# EAGLE board EEZ PSU power board r5B8 (EAGLE 6.1), part 1 of 2
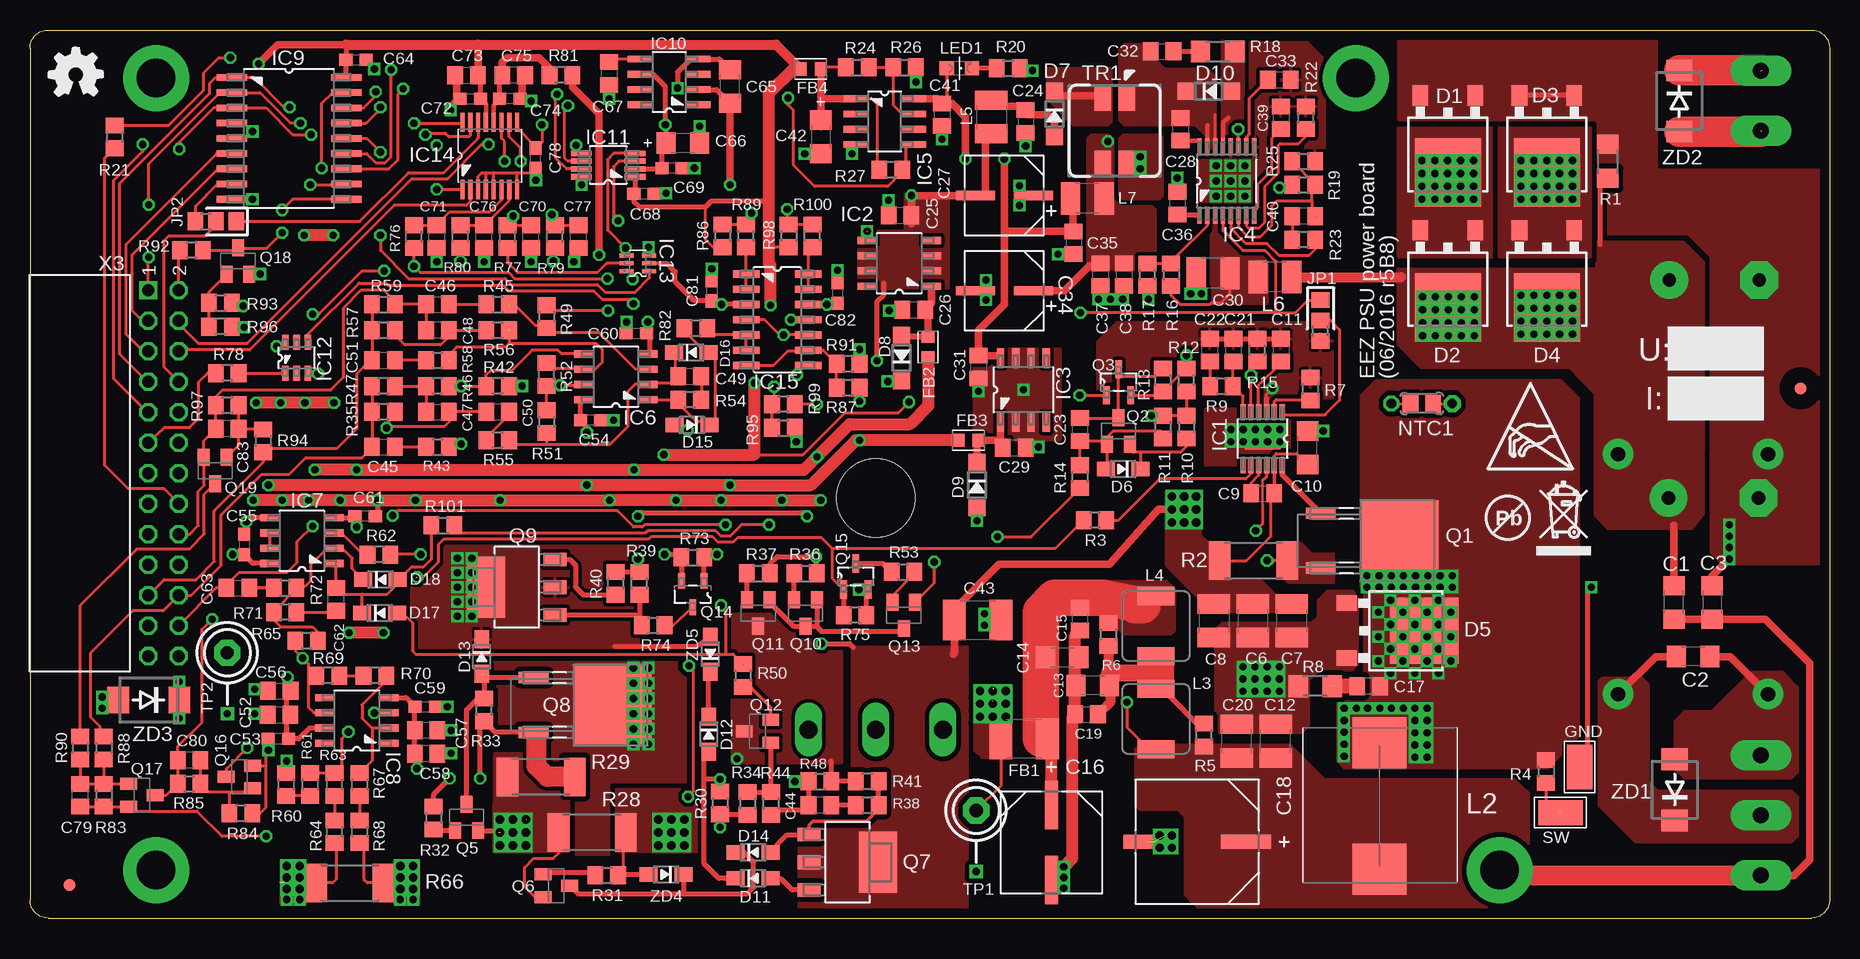
[diagram p5: board, top side]
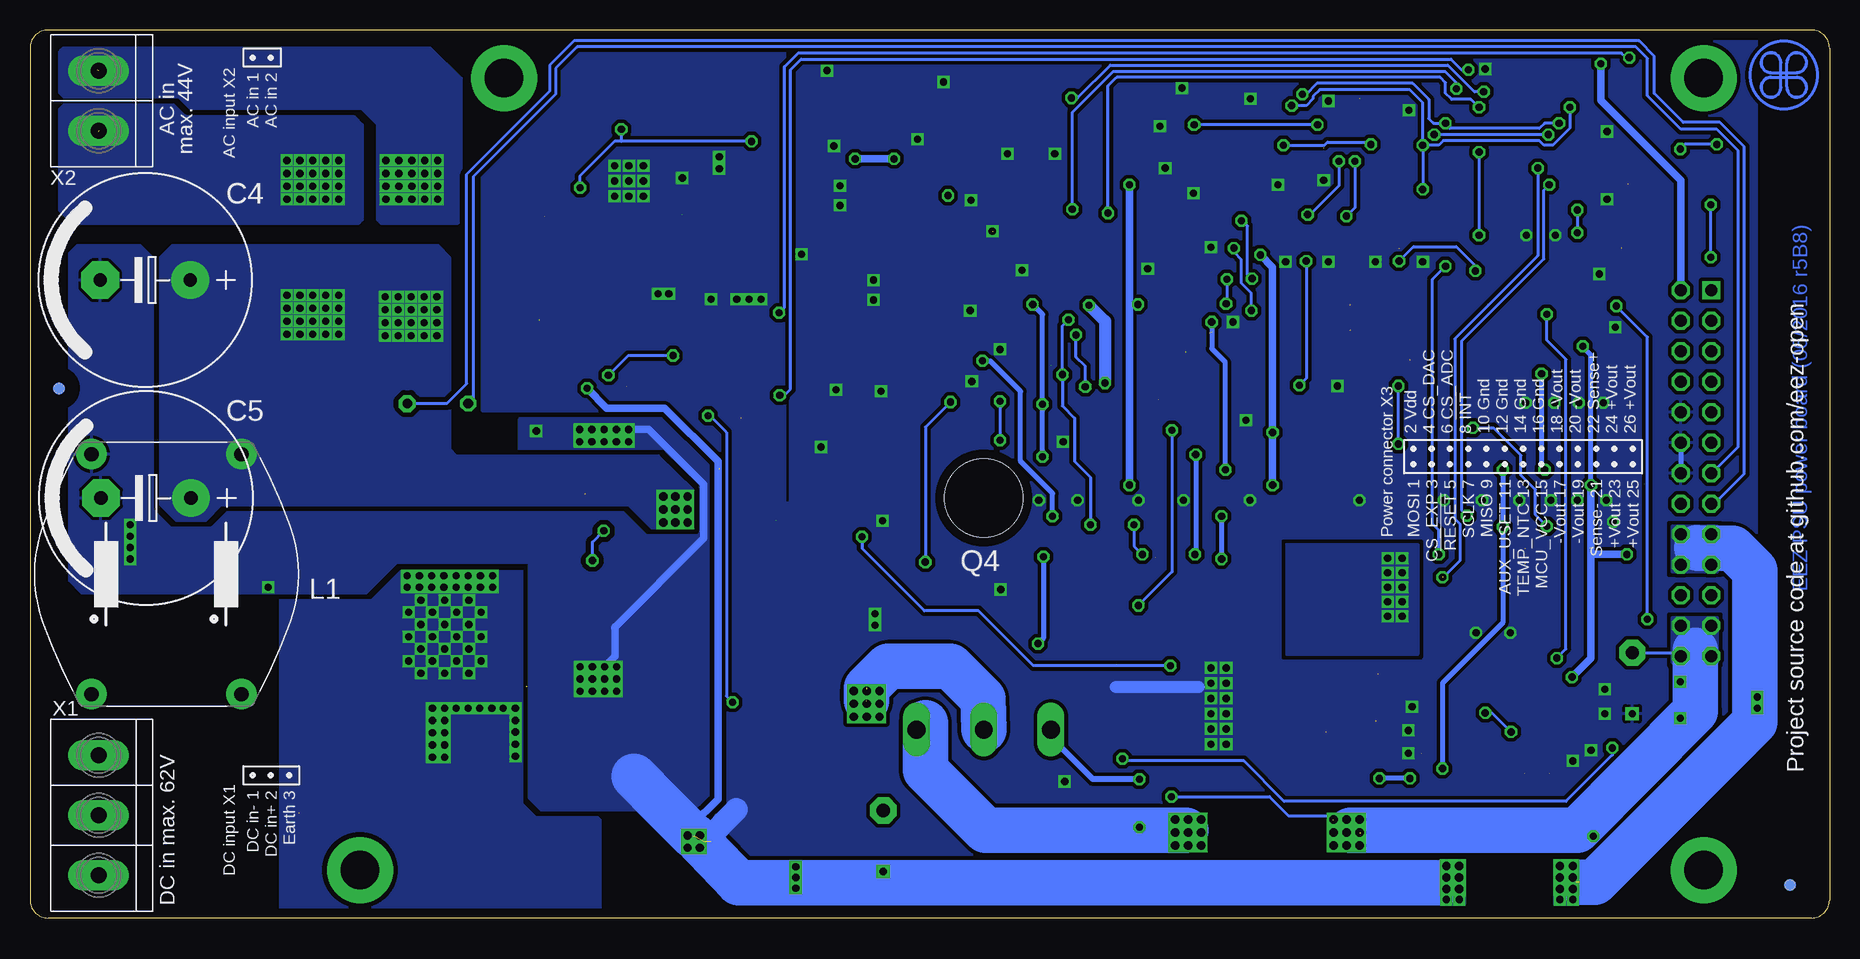
[diagram p6: board, bottom side, seen from below]

Size 150 x 74 mm. Coordinates in mm from the lower left corner, seen from the top.
Outline: 1.5,0 148.5,0 arc90 150,1.5 150,72.5 arc90 148.5,74 1.5,74 arc90 0,72.5 0,1.5 arc90 1.5,0
Copper layers (1+5*16): Top 0.035mm / dielectric 0.75mm / Route5 0.035mm / dielectric 0.75mm / Bottom 0.035mm
Design rules: minimum track width 10mil, minimum drill 0.5mm, track to track 8mil, track to pad 8mil, pad to pad 8mil, via to via 8mil, smd to smd 8mil, copper to edge 30mil, drill to drill 8mil, minimum pad ring 10mil, minimum via ring 8mil, stop-mask expansion 4mil, vias tented up to drill 25mil, thermal gap 10mil
Net classes: 0 default: width 0.254 mm, drill 0.584 mm, clearance 0.254 mm; 1 dgnd: width 0.254 mm, drill 0.584 mm, clearance 0.254 mm; 2 gnd: width 0.254 mm, drill 0.584 mm, clearance 0.254 mm

## Footprints (pad centres in the part's own frame; a part is rotated, then mirrored left to right if it is on the bottom)
C1206 = smd 1.6 x 1.8: 1 -1.4,0; 2 1.4,0
ECAP7.5/18 = drill 1.1 pad 3.14: + -3.75,0 | drill 1.1 pad 3.14 octagon: - 3.75,0
C1210 = smd 1.6 x 2.7: 1 -1.4,0; 2 1.4,0
C0805 = smd 1.3 x 1.5: 1 -0.95,0; 2 0.95,0
CAPAE830X1050N = smd 4.064 x 1.092: 1 -3.124,0; 2 3.124,0
PANASONIC_F = smd 4.166 x 1.194: 1 -4.064,0; 2 4.064,0
CAPAE660X610N = smd 3.251 x 0.762: 1 -2.413,0; 2 2.413,0
EC1206 = smd 1.6 x 1.8: + -1.4,0; - 1.4,0
C1812 = smd 1.9 x 3.4: 1 -1.95,0; 2 1.95,0
C0603 = smd 1.1 x 1: 1 -0.85,0; 2 0.85,0
TO252@1 = smd 1.3 x 1.7: 1 -2.285,-5.49; 2 2.285,-5.49 | smd 5.5 x 5.7: 3 0,0.95
TO252 = smd 1.3 x 1.7: 1 -2.285,-5.49; 2 2.285,-5.49 | smd 5.5 x 5.7: 3 0,0.95
SOD323-W = smd 1.5 x 1.2: A 1.45,0; C -1.45,0
SOD123 = smd 1.4 x 1.4: A 1.9,0; C -1.9,0
L1812 = smd 1.9 x 3.4: 1 -1.95,0; 2 1.95,0
BEAD0603 = smd 1 x 1.1: P$1 -0.85,0; P$2 0.85,0
S1751-46R = smd 3.7 x 2.1: P$1 0,0
LTC_05-08-1666 = smd 1.27 x 0.457: 1 -2.235,1.63; 2 -2.235,0.98; 3 -2.235,0.33; 4 -2.235,-0.33; 5 -2.235,-0.98; 6 -2.235,-1.63; 7 2.235,-1.63; 8 2.235,-0.98; 9 2.235,-0.33; 10 2.235,0.33; 11 2.235,0.98; 12 2.235,1.63 | smd 1.753 x 2.946: TP 0,0
SOIC127P600X173-8N = smd 1.55 x 0.6: 1 -2.7,1.9; 2 -2.7,0.63; 3 -2.7,-0.64; 4 -2.7,-1.91; 5 2.7,-1.91; 6 2.7,-0.64; 7 2.7,0.63; 8 2.7,1.9
SOP65P640X110-16N = smd 1.422 x 0.356: 1 -2.845,2.286; 2 -2.845,1.626; 3 -2.845,0.965; 4 -2.845,0.33; 5 -2.845,-0.33; 6 -2.845,-0.965; 7 -2.845,-1.626; 8 -2.845,-2.286; 9 2.845,-2.286; 10 2.845,-1.626; 11 2.845,-0.965; 12 2.845,-0.33; 13 2.845,0.33; 14 2.845,0.965; 15 2.845,1.626; 16 2.845,2.286
SOIC127P600X175-8N = smd 1.981 x 0.559: 1 -2.464,1.905; 2 -2.464,0.635; 3 -2.464,-0.635; 4 -2.464,-1.905; 5 2.464,-1.905; 6 2.464,-0.635; 7 2.464,0.635; 8 2.464,1.905
SOIC127P1030X265-18N = smd 2.54 x 0.559: 1 -4.775,5.08; 2 -4.775,3.81; 3 -4.775,2.54; 4 -4.775,1.27; 5 -4.775,0; 6 -4.775,-1.27; 7 -4.775,-2.54; 8 -4.775,-3.81; 9 -4.775,-5.08; 10 4.775,-5.08; 11 4.775,-3.81; 12 4.775,-2.54; 13 4.775,-1.27; 14 4.775,0; 15 4.775,1.27; 16 4.775,2.54; 17 4.775,3.81; 18 4.775,5.08
DGK8-M = smd 1.727 x 0.483: 1 -2.235,0.965; 2 -2.235,0.33; 3 -2.235,-0.33; 4 -2.235,-0.965; 5 2.235,-0.965; 6 2.235,-0.33; 7 2.235,0.33; 8 2.235,0.965
SOT95P280X145-6N = smd 1.27 x 0.559: 1 -1.295,0.94; 2 -1.295,0; 3 -1.295,-0.94; 4 1.295,-0.94; 5 1.295,0; 6 1.295,0.94
SOT65P210X110-6N = smd 1.168 x 0.356: 1 -0.94,0.66; 2 -0.94,0; 3 -0.94,-0.66; 4 0.94,-0.66; 5 0.94,0; 6 0.94,0.66
PW(R-PDSO-G16) = smd 1.6 x 0.35: 1 -2.8,2.3; 2 -2.8,1.65; 3 -2.8,1; 4 -2.8,0.35; 5 -2.8,-0.3; 6 -2.8,-0.95; 7 -2.8,-1.6; 8 -2.8,-2.25; 9 2.8,-2.25; 10 2.8,-1.6; 11 2.8,-0.95; 12 2.8,-0.3; 13 2.8,0.35; 14 2.8,1; 15 2.8,1.65; 16 2.8,2.3
SOIC127P600X175-14N = smd 2.2 x 0.6: 1 -2.591,3.81; 2 -2.591,2.54; 3 -2.591,1.27; 4 -2.591,0; 5 -2.591,-1.27; 6 -2.591,-2.54; 7 -2.591,-3.81; 8 2.591,-3.81; 9 2.591,-2.54; 10 2.591,-1.27; 11 2.591,0; 12 2.591,1.27; 13 2.591,2.54; 14 2.591,3.81
A0R-JMP = smd 1.5 x 1.3: 1 0,1.7; 2 0,0; 3 0,-1.7
RN114 = drill 1.2 pad 2.54: 1 -10,6.25; 2 -10,-6.25; 3 10,-6.25; 4 10,6.25
WE-HCI_1350/1365 = smd 4.25 x 4.5: 1 -5.25,0; 2 5.27,0
IHLP-2020BZ-11 = smd 3.048 x 1.524: 1 0,2.515; 2 0,-2.515
L1210 = smd 1.6 x 2.7: 1 -1.4,0; 2 1.4,0
LED_0805 = smd 1.2 x 1.2: A 0,-1.05; C 0,1.05
R_0204/5+0805 = smd 1.3 x 1.5: 1 -0.95,0; 2 0.95,0 | drill 0.813 octagon: 1.1 -2.54,0 | drill 0.8 pad 1.422 octagon: 2.1 2.54,0
TO229P990X239-3N = smd 0.94 x 2.489: 1 -2.286,-6.401; 3 2.286,-6.401 | smd 6.731 x 6.528: 2 0,0.152
SOT23-BEC = smd 1 x 1.4: B -0.95,-1.1; C 0,1.1; E 0.95,-1.1
SOT103P240X110-3N = smd 1.524 x 0.559: 1 -1.079,1.016; 2 -1.079,-1.016; 3 1.079,0
TO247BH-CLR = drill 1.499 long: D 0,-19.304; G -5.588,-19.304; S 5.588,-19.304 | hole 6.5: 0,0
SOT230P700X180-4N = smd 1.905 x 1.143: 1 -3.2,2.311; 2 -3.2,0; 3 -3.2,-2.311 | smd 3.175 x 5.08: 4 2.565,0
SOT95P237X112-3N = smd 1.321 x 0.559: 1 -1.092,0.94; 2 -1.092,-0.94; 3 1.092,0
R1206 = smd 1.6 x 1.803: 1 -1.422,0; 2 1.422,0
R2512 = smd 1.8 x 3.2: 1 -2.8,0; 2 2.8,0
R0805 = smd 1.3 x 1.5: 1 -0.95,0; 2 0.95,0
SHORT_NOHOLE = smd 0.5 x 0.25 bottom: P$1 0,0.117; P$2 0,-0.117
TP_1.1MM = drill 0.6 square: GND 5.08,0 | drill 1.1 pad 2.184 octagon: TIP 0,0
SRF0703 = smd 1.4 x 2.1: 1 1,2.7; 2 -1,2.7; 3 -1,-2.7; 4 1,-2.7
FIDUCIAL_DUAL = smd 1.016 x 1.016 bottom: B 0,0 | smd 1.016 x 1.016: T 0,0
TBLOCK5.0_3 = drill 1.35 pad 2.54 long: 1 0,0; 2 0,-5; 3 0,-10
TBLOCK5.0_2 = drill 1.35 pad 2.54 long: 1 0,0; 2 0,-5
SSW-113-02-T-D-RA = drill 1 pad 1.5 square: 1 30.48,2.54 | drill 1 pad 1.5 octagon: 2 30.48,0; 3 27.94,2.54; 4 27.94,0; 5 25.4,2.54; 6 25.4,0; 7 22.86,2.54; 8 22.86,0; 9 20.32,2.54; 10 20.32,0; 11 17.78,2.54; 12 17.78,0; 13 15.24,2.54; 14 15.24,0; 15 12.7,2.54; 16 12.7,0; 17 10.16,2.54; 18 10.16,0; 19 7.62,2.54; 20 7.62,0; 21 5.08,2.54; 22 5.08,0; 23 2.54,2.54; 24 2.54,0; 25 0,2.54; 26 0,0
DO214AA = smd 1.8 x 2.2: A 2.55,0; C -2.55,0

## Placement (x,y rotation side)
C1  100n  [C1206]  137.03,26.3 90 top
C2  100n  [C1206]  138.62,21.79 180 top
C3  100n  [C1206]  140.21,26.3 270 top
C4  2m2  [ECAP7.5/18]  140.4,53.16 180 bottom
C5  2m2  [ECAP7.5/18]  140.34,35 180 bottom
C6  4u7  [C1210]  101.92,24.77 270 top
C7  4u7  [C1210]  105.16,24.77 270 top
C8  4u7  [C1210]  98.68,24.77 270 top
C9  470n  [C0805]  102.74,35.38 0 top
C10  1u  [C1206]  106.49,39.19 90 top
C11  100n  [C0805]  104.27,47.32 270 top
C12  10u  [C1210]  103.82,14.74 90 top
C13  1u  [C1206]  88.58,19.38 180 top
C14  1u  [C1206]  86.04,21.73 0 top
C15  100n  [C0805]  87.5,24.9 270 top
C16  EEEFK1J470P  [CAPAE830X1050N]  85.15,6.3 270 top
C17  330p  [C0805]  111.57,19.31 180 top
C18  EEEFK1J101P  [PANASONIC_F]  97.28,6.36 180 top
C19  100n  [C0805]  88.07,16.96 0 top
C20  10u  [C1210]  100.58,14.74 90 top
C21  120p  [C0805]  100.33,47.32 90 top
C22  4n7  [C0805]  98.36,47.32 90 top
C23  470p  [C0805]  87.5,40.71 270 top
C24  2u2  [C0805]  82.99,66.37 270 top
C25  330n  [C0805]  72.52,58.56 0 top
C26  100n  [C0805]  73.66,50.68 0 top
C27  47u  [CAPAE660X610N]  81.22,60.21 180 top
C28  22n  [C0805]  95.89,65.73 270 top
C29  100n  [C0805]  82.04,39.19 0 top
C30  2u2/100V  [C1210]  98.62,53.73 180 top
C31  330n  [C0805]  79.06,45.92 270 top
C32  330p  [C0805]  94.36,72.21 0 top
C33  10n  [C0805]  104.14,69.86 0 top
C34  47u  [CAPAE660X610N]  81.22,52.27 180 top
C35  2u2  [C0805]  87,56.27 270 top
C36  100n  [C0805]  95.63,59.57 270 top
C37  2u2  [C0805]  89.22,53.6 270 top
C38  2u2  [C0805]  91.19,53.6 270 top
C39  3n3  [C0805]  104.27,66.68 270 top
C40  1n  [C0805]  106.17,58.49 180 top
C41  100n  [C0805]  76.01,66.94 270 top
C42  4u7  [EC1206]  65.91,65.1 270 top
C43  470n  [C1812]  78.99,24.84 0 top
C44  10n  [C0805]  65.85,9.41 180 top
C45  47p  [C0805]  29.46,39.25 0 top
C46  1n  [C0805]  33.97,51.13 0 top
C47  2n2  [C0805]  33.97,42.17 0 top
C48  2n2  [C0805]  33.97,48.97 180 top
C49  120p  [C0805]  54.99,45.16 0 top
C50  1n  [C0805]  38.99,42.17 0 top
C51  47p  [C0805]  29.46,46.48 0 top
C52  10n  [C0805]  20.76,16.93 0 top
C53  100n  [C0603]  20.7,14.93 180 top
C54  100n  [C0603]  46.74,41.47 180 top
C55  100n  [C0603]  17.84,31.12 270 top
C56  1u  [C0805]  20.78,18.92 0 top
C57  10n  [C0805]  33.02,15.63 180 top
C58  1u  [C0805]  33.02,13.68 180 top
C59  100n  [C0603]  32.96,17.6 0 top
C60  100n  [C0603]  50.55,48.71 0 top
C61  100n  [C0603]  27.94,33.47 180 top
C62  1n  [C0805]  25.53,26.55 90 top
C63  1n  [C0805]  17.34,27.5 0 top
C64  100n  [C0603]  27.18,71.51 0 top
C65  10u  [C1206]  58.36,69.29 90 top
C66  10u  [EC1206]  54.42,64.59 0 top
C67  1u  [C0805]  48.26,70.37 270 top
C68  100n  [C0603]  51.18,60.33 180 top
C69  100n  [C0603]  53.53,62.49 180 top
C70  3n3  [C0805]  41.78,56.78 90 top
C71  3n3  [C0805]  33.91,56.78 270 top
C72  100n  [C0603]  36.7,68.27 0 top
C73  1u  [C0805]  36.39,70.24 0 top
C74  100n  [C0603]  40.01,68.27 180 top
C75  1u  [C0805]  40.32,70.24 180 top
C76  3n3  [C0805]  37.85,56.78 90 top
C77  3n3  [C0805]  45.72,56.78 90 top
C78  100n  [C0603]  42.16,63.32 90 top
C79  10n  [C0805]  4.19,10.23 90 top
C80  2n2  [C0805]  13.27,13.15 180 top
C81  100n  [C0603]  56.83,52.27 270 top
C82  100n  [C0603]  67.31,52.08 270 top
C83  10n  [C0805]  16.45,40.78 180 top
D1  STPS15H100  [TO252@1]  118.17,63.06 180 top
D2  STPS15H100  [TO252@1]  118.17,51.83 180 top
D3  STPS15H100  [TO252@1]  126.43,63.06 180 top
D4  STPS15H100  [TO252@1]  126.43,51.83 180 top
D5  STPS15H100  [TO252]  115.25,23.95 270 top
D6  BAS316  [SOD323-W]  91.12,37.41 180 top
D7  DFLS1100-7  [SOD123]  85.41,67 270 top
D8  SKL16  [SOD123]  72.64,46.68 90 top
D9  SKL16  [SOD123]  78.93,36.08 270 top
D10  DFLS1100-7  [SOD123]  98.23,68.91 0 top
D11  BAS316  [SOD323-W]  60.26,3.31 0 top
D12  BAS316  [SOD323-W]  56.58,15.31 270 top
D13  BAS316  [SOD323-W]  37.66,21.79 270 top
D14  BAS316  [SOD323-W]  60.26,5.47 0 top
D15  BAS316  [SOD323-W]  55.18,41.09 180 top
D16  BAS316  [SOD323-W]  55.12,47.13 0 top
D17  BAS316  [SOD323-W]  29.15,25.41 0 top
D18  BAS316  [SOD323-W]  29.21,28.2 0 top
EEZ_SIGNATURE  SIGNATURESMALL  [SIGNATURE_5MM]  3.81,70.25 180 top
FB1  2743019447  [L1812]  82.87,14.93 180 top
FB2  60R@100MHz  [BEAD0603]  74.87,47.57 270 top
FB3  60R@100MHz  [BEAD0603]  78.23,39.82 180 top
FB4  60R@100MHz  [BEAD0603]  65.09,70.75 180 top
GND  S1751-46R  [S1751-46R]  129.16,12.58 90 top
IC1  LTC3864  [LTC_05-08-1666]  102.74,39.95 270 top
IC2  MC79L05  [SOIC127P600X173-8N]  72.45,54.56 180 top
IC3  MC78L05  [SOIC127P600X173-8N]  82.8,44.02 90 top
IC4  LM5574  [SOP65P640X110-16N]  99.76,61.41 90 top
IC5  LP2951SO8  [SOIC127P600X175-8N]  71.25,66.37 0 top
IC6  TL072D  [SOIC127P600X173-8N]  48.83,45.09 180 top
IC7  TL072D  [SOIC127P600X173-8N]  22.67,31.44 180 top
IC8  OP27GSZ  [SOIC127P600X173-8N]  27.24,16.46 180 top
IC9  MCP23S08-E/SO  [SOIC127P1030X265-18N]  21.59,64.97 0 top
IC10  REF5025  [SOIC127P600X175-8N]  53.28,69.67 180 top
IC11  DAC8552  [DGK8-M]  48.2,62.75 180 top
IC12  ADG465SOT-23  [SOT95P280X145-6N]  22.23,46.68 90 top
IC13  TS5A9411DCKT  [SOT65P210X110-6N]  50.67,54.56 180 top
IC14  ADS1120  [PW(R-PDSO-G16)]  38.35,63.51 90 top
IC15  LP339D  [SOIC127P600X175-14N]  62.29,49.86 0 top
JP1  0R-JUMPA  [A0R-JMP]  107.57,49.79 180 top
JP2  0R-JUMPA  [A0R-JMP]  15.49,58.05 90 top
L1  RN114-4/02  [RN114]  138.62,28.65 90 bottom
L2  7443551331  [WE-HCI_1350/1365]  112.46,9.34 270 top
L3  IHLP2020CZER3R3M11  [IHLP-2020BZ-11]  93.85,16.58 180 top
L4  IHLP2020CZER3R3M11  [IHLP-2020BZ-11]  93.85,24.33 180 top
L5  2u2  [L1210]  80.14,66.75 270 top
L6  2u2  [L1210]  103.76,53.41 180 top
L7  2u2  [L1210]  88.14,59.95 180 top
LED1  HSMY-C170  [LED_0805]  77.47,70.81 270 top
NTC1  10K/Beta:3570K  [R_0204/5+0805]  116.01,42.87 0 top
Q1  SUD19P06-60  [TO229P990X239-3N]  113.98,31.44 270 top
Q2  MMBT5401  [SOT23-BEC]  90.74,40.59 0 top
Q3  2N7002  [SOT103P240X110-3N]  90.74,44.65 90 top
Q4  IRFP250N  [TO247BH-CLR]  70.5,35 0 top
Q5  BC857C  [SOT23-BEC]  36.39,8.39 0 top
Q6  BC846C  [SOT23-BEC]  43.88,2.68 270 top
Q7  BCP56-16.115  [SOT230P700X180-4N]  68.14,4.64 0 top
Q8  IRFR5410  [TO229P990X239-3N]  48.39,17.75 270 top
Q9  BCP56-16.115  [SOT230P700X180-4N]  40.58,27.57 180 top
Q10  MMBT5401  [SOT23-BEC]  64.64,25.41 180 top
Q11  MMBT5401  [SOT23-BEC]  60.71,25.41 180 top
Q12  MMBT5551  [SOT23-BEC]  60.64,15.57 90 top
Q13  MMBT5551  [SOT23-BEC]  72.83,25.22 180 top
Q14  BSS84P  [SOT95P237X112-3N]  55.24,27 270 top
Q15  2N7002  [SOT103P240X110-3N]  68.83,28.46 90 top
Q16  MMBT5551  [SOT23-BEC]  17.46,11.76 90 top
Q17  MMBT5401  [SOT23-BEC]  9.33,10.23 270 top
Q18  MMBT5551  [SOT23-BEC]  17.34,54.75 0 top
Q19  MMBT5551  [SOT23-BEC]  15.43,37.28 180 top
R1  12K  [R1206]  131.51,63.06 90 top
R2  R010/2W  [R2512]  101.98,29.79 0 top
R3  0R  [R0805]  88.77,33.16 180 top
R4  1K  [R0805]  126.36,12.2 270 top
R5  100R  [R0805]  97.85,15.25 90 top
R6  100R  [R0805]  89.92,23.63 90 top
R7  47K  [R0805]  106.74,44.08 90 top
R8  10R  [R1206]  107.12,19.31 0 top
R9  10K  [R0805]  99.31,44.33 0 top
R10  10K  [R0805]  96.39,40.9 270 top
R11  100K  [R0805]  94.42,40.9 270 top
R12  324K  [R0805]  96.39,44.84 90 top
R13  0R  [R0805]  94.42,44.84 270 top
R14  100K  [R0805]  87.5,36.78 270 top
R15  4K32  [R0805]  102.3,47.32 90 top
R16  39K  [R0805]  95.12,53.6 270 top
R17  1K8  [R0805]  93.15,53.6 90 top
R18  10R  [R1206]  99,72.21 180 top
R19  30K  [R0805]  106.17,61.1 0 top
R20  390R  [R0805]  81.53,70.81 0 top
R21  0R  [R0805]  7.05,65.1 270 top
R22  20K  [R0805]  106.36,66.68 90 top
R23  51K  [R0805]  106.17,56.52 180 top
R24  12K  [R0805]  68.96,70.88 0 top
R25  4K7  [R0805]  106.17,63.06 0 top
R26  3K9  [R0805]  72.9,70.88 0 top
R27  10K  [R0805]  71.75,62.37 0 top
R28  R080/3W  [R2512]  46.86,7.12 180 top
R29  2R2/2W  [R2512]  42.61,11.76 180 top
R30  2K2  [R0805]  57.53,9.6 270 top
R31  1K  [R0805]  48.07,3.57 0 top
R32  2K2  [R0805]  33.66,8.33 270 top
R33  2K2  [R0805]  37.85,17.34 90 top
R34  16K  [R0805]  59.82,9.53 270 top
R35  2K  [R0805]  29.46,42.17 180 top
R36  220R  [R0805]  64.64,28.71 0 top
R37  220R  [R0805]  60.71,28.71 0 top
R38  470R  [R0805]  69.79,9.41 0 top
R39  1K  [R0805]  50.8,27.89 90 top
R40  220R  [R0805]  48.83,27.89 90 top
R41  100R  [R0805]  69.79,11.38 180 top
R42  7K5  [R0805]  38.99,44.33 180 top
R43  10K  [R0805]  33.97,39.25 0 top
R44  560R  [R0805]  61.79,9.53 90 top
R45  220R  [R0805]  38.99,51.13 0 top
R46  100K  [R0805]  33.97,44.33 180 top
R47  20K  [R0805]  29.46,44.33 180 top
R48  51K  [R0805]  65.85,11.38 0 top
R49  10K  [R0805]  43.05,50.11 270 top
R50  470R  [R0805]  59.44,20.2 270 top
R51  10K  [R0805]  43.05,41.36 270 top
R52  7K5  [R0805]  43.05,45.28 90 top
R53  1K8  [R0805]  72.77,28.84 0 top
R54  0R  [R0805]  54.99,43.19 180 top
R55  220R  [R0805]  38.99,39.82 0 top
R56  100K  [R0805]  38.99,48.97 180 top
R57  20K  [R0805]  29.46,48.97 180 top
R58  10K  [R0805]  33.97,46.48 0 top
R59  2K  [R0805]  29.46,51.13 0 top
R60  180R 0.1%  [R0805]  21.34,11.12 270 top
R61  3K9 0.1%  [R0805]  23.37,11.12 90 top
R62  2K2  [R0805]  29.09,30.28 180 top
R63  51R 0.1%  [R0805]  25.4,11.12 90 top
R64  51R 0.1%  [R0805]  25.4,7.19 90 top
R65  2K2  [R0805]  23.06,23.12 0 top
R66  R020/2W  [R2512]  26.67,2.93 0 top
R67  51R 0.1%  [R0805]  27.5,11.12 90 top
R68  51R 0.1%  [R0805]  27.5,7.19 90 top
R69  3K9 0.1%  [R0805]  24.83,20.2 180 top
R70  180R 0.1%  [R0805]  28.77,20.2 180 top
R71  11K  [R0805]  21.27,25.47 180 top
R72  10K  [R0805]  21.27,27.5 0 top
R73  100K  [R0805]  55.24,30.05 0 top
R74  10K  [R0805]  51.94,24.39 0 top
R75  100K  [R0805]  68.77,25.22 180 top
R76  220R  [R0805]  32,56.78 90 top
R77  220R  [R0805]  39.81,56.78 90 top
R78  1K  [R0805]  16.45,45.41 180 top
R79  220R  [R0805]  43.75,56.78 90 top
R80  220R  [R0805]  35.88,56.78 90 top
R81  10R  [R0805]  44.26,70.24 180 top
R82  10K  [R0805]  55.5,49.16 0 top
R83  330R  [R0805]  6.16,10.23 270 top
R84  47K  [R0805]  17.59,8.71 180 top
R85  47K  [R0805]  13.27,11.19 0 top
R86  5K1  [R0805]  57.72,56.84 270 top
R87  47K  [R0805]  68.2,44.21 0 top
R88  750R  [R0805]  6.16,14.17 270 top
R89  5K6  [R0805]  59.69,56.84 90 top
R90  3K3  [R0805]  4.19,14.17 270 top
R91  2K2  [R0805]  68.2,46.17 180 top
R92  10K  [R0805]  13.46,55.64 180 top
R93  10K  [R0805]  15.88,51.25 0 top
R94  750R  [R0805]  19.43,39.76 270 top
R95  10K  [R0805]  62.8,40.84 0 top
R96  47K  [R0805]  15.88,49.29 180 top
R97  330R  [R0805]  16.45,42.75 0 top
R98  5K1  [R0805]  63.25,56.84 270 top
R99  12K  [R0805]  62.8,42.81 180 top
R100  5K6  [R0805]  65.21,56.84 90 top
R101  10K  [R0805]  34.42,32.71 0 top
SH1  Pgnd to Pout- short  [SHORT_NOHOLE]  94.74,6.99 180 top
SH2  Sgnd to Pgnd short  [SHORT_NOHOLE]  94.68,6.8 270 top
SW  S1751-46R  [S1751-46R]  127.57,8.77 0 top
TP1  [TP_1.1MM]  78.87,8.96 270 top
TP2  [TP_1.1MM]  16.45,22.11 270 top
TR1  SRF0703-821M  [SRF0703]  90.42,65.6 0 top
U$2  [RECYCLE_BIN1/8]  125.54,30.24 0 top
U$3  [PB_SMALL]  123.19,33.35 0 top
U$4  [ESD_SYMBOL]  121.51,37.45 0 top
U$11  FIDUCIAL_2  [FIDUCIAL_DUAL]  3.3,2.74 0 top
U$12  FIDUCIAL_2  [FIDUCIAL_DUAL]  147.57,44.14 0 top
X1  282836-3  [TBLOCK5.0_3]  144.27,3.57 180 bottom
X2  282836-2  [TBLOCK5.0_2]  144.27,65.6 180 bottom
X3  SSW-113-02-T-D-RA  [SSW-113-02-T-D-RA]  12.4,21.83 90 top
ZD1  n.c.  [DO214AA]  137.1,10.68 90 top
ZD2  n.c.  [DO214AA]  137.48,68.08 270 top
ZD3  See Note 3.2  [DO214AA]  9.91,18.17 180 top
ZD4  BZX384-C15.115  [SOD323-W]  53.02,3.63 180 top
ZD5  PDZ6.2B  [SOD323-W]  56.71,21.98 90 top